# Altium project MainBoard.PrjPcb
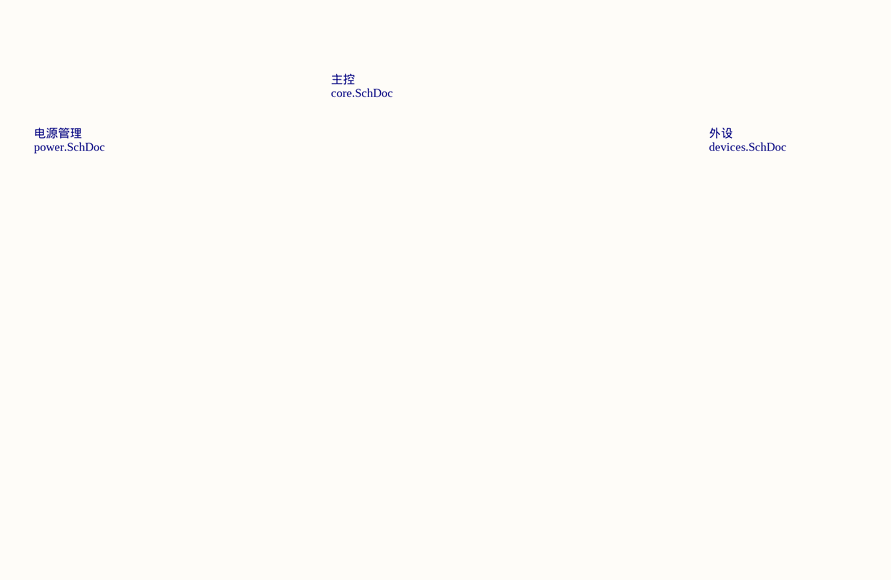
[diagram p0: main.SchDoc]
4 sheets, 74 parts. Net scope: flat (ports and power ports of the same name join across sheets).
Board file: MainBoard.PcbDoc
Sheets:
  main.SchDoc
    主控 = core.SchDoc
    电源管理 = power.SchDoc
    外设 = devices.SchDoc

## Sheet main.SchDoc
size A4

### Parts
LOGO1  (no value)  [JMU_LOGO(1.35cm)]

### Sub-sheets
主控 = core.SchDoc: no entries
外设 = devices.SchDoc: no entries
电源管理 = power.SchDoc: no entries

### Library data of the parts
LOGO1 = JMU_LOGO: LOGO

## Sheet core.SchDoc
size A4
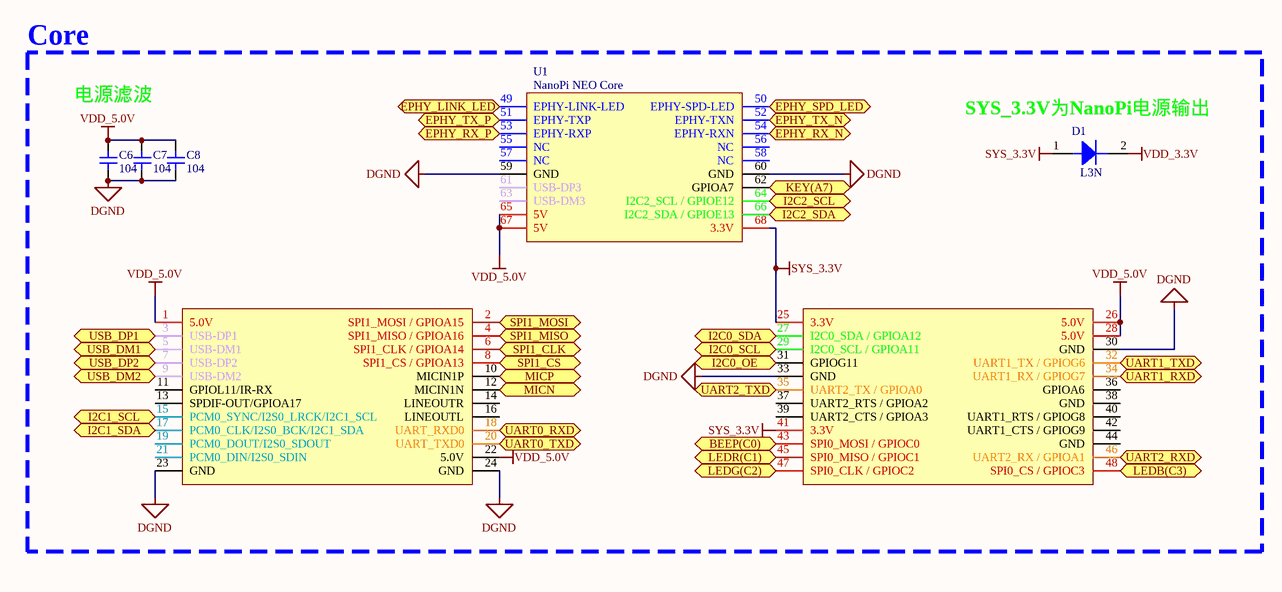
[diagram p1: core.SchDoc]

### Parts
C6  104  [0805C]
C7  104  [0805C]
C8  104  [0805C]
D1  L3N  [SOD-123]
U1  NanoPi NEO Core  [NanoPi NEO Core(无引脚名)]

### Ports
BEEP(C0), EPHY_LINK_LED, EPHY_RX_N, EPHY_RX_P, EPHY_SPD_LED, EPHY_TX_N, EPHY_TX_P, I2C0_OE, I2C0_SCL, I2C0_SDA, I2C1_SCL, I2C1_SDA, I2C2_SCL, I2C2_SDA, KEY(A7), LEDB(C3), LEDG(C2), LEDR(C1), MICN, MICP, SPI1_CLK, SPI1_CS, SPI1_MISO, SPI1_MOSI, UART0_RXD, UART0_TXD, UART1_RXD, UART1_TXD, UART2_RXD, UART2_TXD, USB_DM1, USB_DM2, USB_DP1, USB_DP2

### Nets
DGND: C6.1 C7.1 C8.1 U1.23(GND) U1.24(GND) U1.30(GND) U1.33(GND) U1.59(GND) U1.60(GND)
SYS_3.3V: D1.1 U1.25(3.3V) U1.41(3.3V) U1.68(3.3V)
VDD_3.3V: D1.2
VDD_5.0V: C6.2 C7.2 C8.2 U1.1(5.0V) U1.22(5.0V) U1.26(5.0V) U1.28(5.0V) U1.65(5V) U1.67(5V)
BEEP(C0): U1.43(SPI0_MOSI_/_GPIOC0) ; port BEEP(C0)
EPHY_LINK_LED: U1.49(EPHY-LINK-LED) ; port EPHY_LINK_LED
EPHY_SPD_LED: U1.50(EPHY-SPD-LED) ; port EPHY_SPD_LED
I2C0_OE: U1.31(GPIOG11) ; port I2C0_OE
I2C0_SCL: U1.29(I2C0_SCL_/_GPIOA11) ; port I2C0_SCL
I2C0_SDA: U1.27(I2C0_SDA_/_GPIOA12) ; port I2C0_SDA
I2C1_SCL: U1.15(PCM0_SYNC/I2S0_LRCK/I2C1_SCL) ; port I2C1_SCL
I2C1_SDA: U1.17(PCM0_CLK/I2S0_BCK/I2C1_SDA) ; port I2C1_SDA
I2C2_SCL: U1.64(I2C2_SCL_/_GPIOE12) ; port I2C2_SCL
I2C2_SDA: U1.66(I2C2_SDA_/_GPIOE13) ; port I2C2_SDA
KEY(A7): U1.62(GPIOA7) ; port KEY(A7)
LEDB(C3): U1.48(SPI0_CS_/_GPIOC3) ; port LEDB(C3)
LEDG(C2): U1.47(SPI0_CLK_/_GPIOC2) ; port LEDG(C2)
LEDR(C1): U1.45(SPI0_MISO_/_GPIOC1) ; port LEDR(C1)
MICN: U1.12(MICIN1N) ; port MICN
MICP: U1.10(MICIN1P) ; port MICP
RXIN: U1.54(EPHY-RXN) ; port EPHY_RX_N
RXIP: U1.53(EPHY-RXP) ; port EPHY_RX_P
SPI1_CLK: U1.6(SPI1_CLK_/_GPIOA14) ; port SPI1_CLK
SPI1_CS: U1.8(SPI1_CS_/_GPIOA13) ; port SPI1_CS
SPI1_MISO: U1.4(SPI1_MISO_/_GPIOA16) ; port SPI1_MISO
SPI1_MOSI: U1.2(SPI1_MOSI_/_GPIOA15) ; port SPI1_MOSI
TXON: U1.52(EPHY-TXN) ; port EPHY_TX_N
TXOP: U1.51(EPHY-TXP) ; port EPHY_TX_P
UART0_RXD: U1.18(UART_RXD0) ; port UART0_RXD
UART0_TXD: U1.20(UART_TXD0) ; port UART0_TXD
UART1_RXD: U1.34(UART1_RX_/_GPIOG7) ; port UART1_RXD
UART1_TXD: U1.32(UART1_TX_/_GPIOG6) ; port UART1_TXD
UART2_RXD: U1.46(UART2_RX_/_GPIOA1) ; port UART2_RXD
UART2_TXD: U1.35(UART2_TX_/_GPIOA0) ; port UART2_TXD
USB_DM1: U1.5(USB-DM1) ; port USB_DM1
USB_DM2: U1.9(USB-DM2) ; port USB_DM2
USB_DP1: U1.3(USB-DP1) ; port USB_DP1
USB_DP2: U1.7(USB-DP2) ; port USB_DP2

Not connected (* = marked no-connect by the designer): U1 11(GPIOL11/IR-RX) 13(SPDIF-OUT/GPIOA17) 14(LINEOUTR) 16(LINEOUTL) 19(PCM0_DOUT/I2S0_SDOUT) 21(PCM0_DIN/I2S0_SDIN) 36(GPIOA6) 37(UART2_RTS_/_GPIOA2) 38(GND) 39(UART2_CTS_/_GPIOA3) 40(UART1_RTS_/_GPIOG8) 42(UART1_CTS_/_GPIOG9) 44(GND) 55(NC) 56(NC) 57(NC) 58(NC) 61(USB-DP3) 63(USB-DM3)

### Notes on the sheet
- Core
- 电源滤波
- (near U1) SYS_3.3V为NanoPi电源输出

### Library data of the parts
C6-C8 = Cap1: 无极贴片电容
D1 = Diode: 二极管30V/2A

## Sheet power.SchDoc
size A3
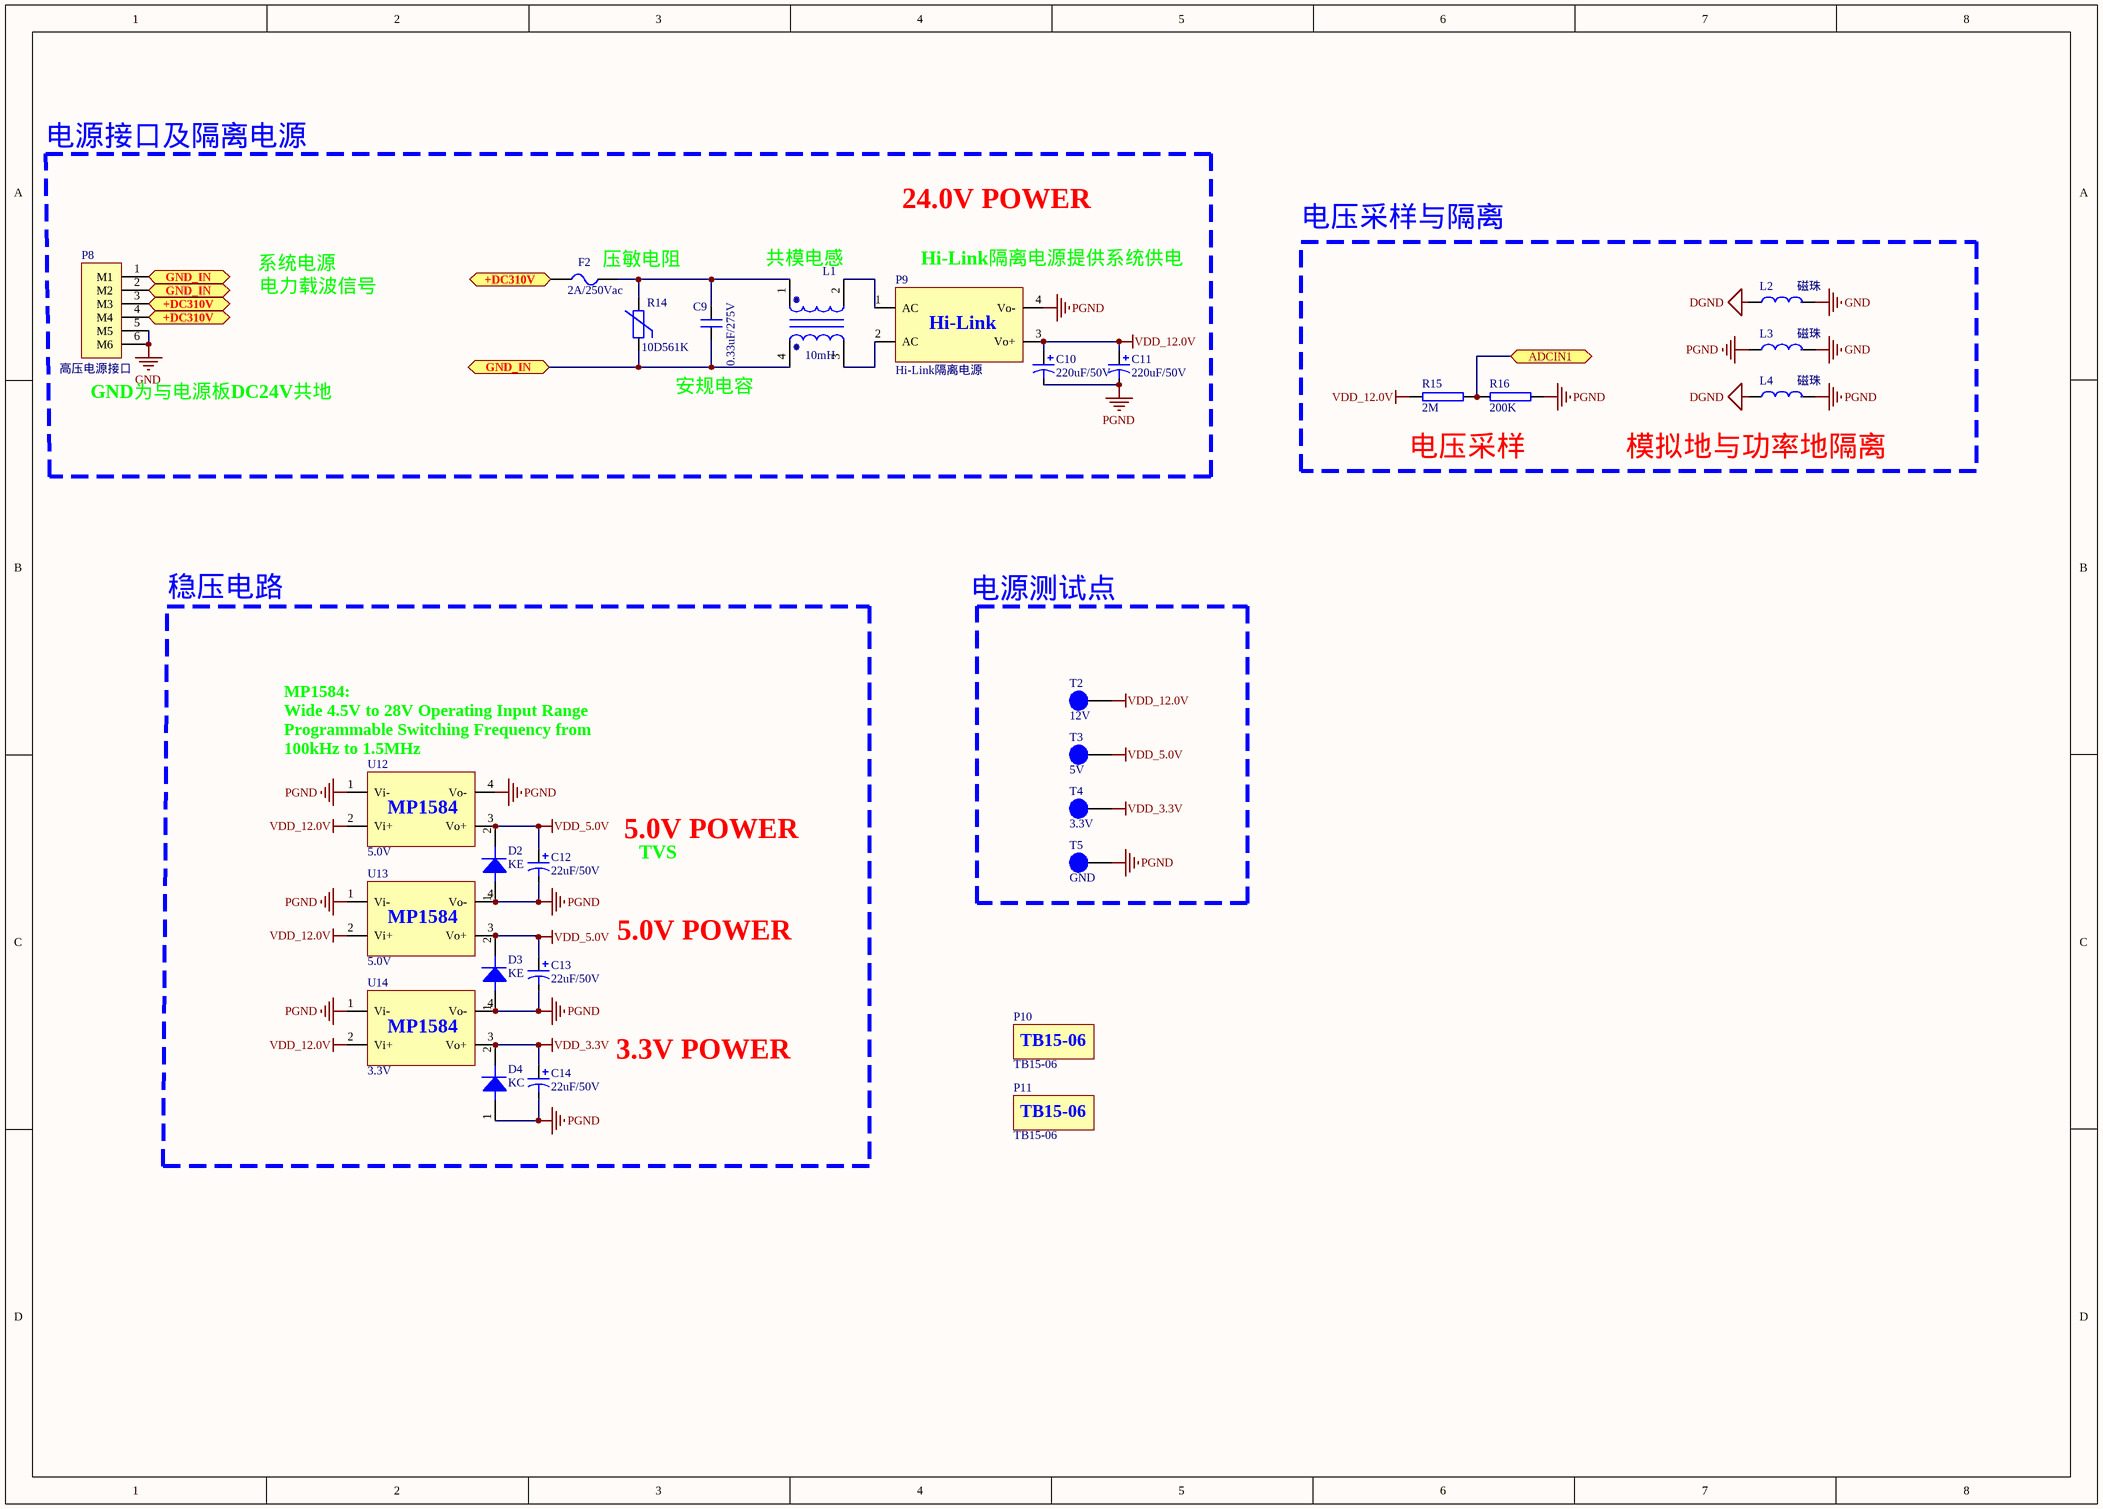
[diagram p2: power.SchDoc]

### Parts
C9  0.33uF/275V  [CX 15*18*11]
C10  220uF/50V  [CAP 5.0*10*12.5-H - GD]
C11  220uF/50V  [CAP 5.0*10*12.5-H - GD]
C12  22uF/50V  [CM D(6.3*5.4)]
C13  22uF/50V  [CM D(6.3*5.4)]
C14  22uF/50V  [CM D(6.3*5.4)]
D2  KE  [SMA]
D3  KE  [SMA]
D4  KC  [SMA]
F2  2A/250Vac  [FU 5x20]
L1  10mH  [T12x6x4]
L2  磁珠  [1206L]
L3  磁珠  [1206L]
L4  磁珠  [1206L]
P8  高压电源接口  [PH2.0WS-6P]
P9  Hi-Link隔离电源  [HLK-20M24]
P10  TB15-06  [TB1506]
P11  TB15-06  [TB1506]
R14  10D561K  [VDR 10D-4.5]
R15  2M  [0805R]
R16  200K  [0805R]
T2  12V  [HEADER 1]
T3  5V  [HEADER 1]
T4  3.3V  [HEADER 1]
T5  GND  [HEADER 1]
U12  5.0V  [MP1584电源模块]
U13  5.0V  [MP1584电源模块]
U14  3.3V  [MP1584电源模块]

### Ports
+DC310V, +DC310V (bidir), ADCIN1, GND_IN

### Nets
DGND: L2.1 L4.1
GND: L2.2 L3.2 P8.5(M5) P8.6(M6)
PGND: C10.2 C11.2 C12.2 C13.2 C14.2 D2.1 D3.1 D4.1 L3.1 L4.2 P9.4(Vo-) R16.2 T5.1 U12.1(Vi-) U12.4(Vo-) U13.1(Vi-) U13.4(Vo-) U14.1(Vi-) U14.4(Vo-)
VDD_3.3V: C14.1 D4.2 T4.1 U14.3(Vo+)
VDD_5.0V: C12.1 C13.1 D2.2 D3.2 T3.1 U12.3(Vo+) U13.3(Vo+)
VDD_12.0V: C10.1 C11.1 P9.3(Vo+) R15.1 T2.1 U12.2(Vi+) U13.2(Vi+) U14.2(Vi+)
+DC310V: F2.1 P8.3(M3) P8.4(M4) ; port +DC310V
ADCIN1: R15.2 R16.1 ; port ADCIN1
GND_IN: C9.1 L1.4 P8.1(M1) P8.2(M2) R14.1 ; port GND_IN
NetC9_2: C9.2 F2.2 L1.1 R14.2
NetL1_2: L1.2 P9.1(AC)
NetL1_3: L1.3 P9.2(AC)

### Notes on the sheet
- 电源接口及隔离电源
- 24.0V POWER
- 电压采样与隔离
- 系统电源
- 电力载波信号
- (near F2) 压敏电阻
- (near L1) 共模电感
- (near P9) Hi-Link隔离电源提供系统供电
- (near P8) GND为与电源板DC24V共地
- 安规电容
- 电压采样
- (near L4) 模拟地与功率地隔离
- 稳压电路
- 电源测试点
- (near U12) MP1584:
  Wide 4.5V to 28V Operating Input Range
  Programmable Switching Frequency from
  100kHz to 1.5MHz
- 5.0V POWER
- TVS
- 3.3V POWER
- (in symbol HILINK-24V) Hi-Link
- (in symbol MP1584电源模块) MP1584

### Library data of the parts
C9 = Cap2: 安规电容
C10-C14 = Cap3: 直插极性电容
D2-D4 = Diode: 二极管
F2 = Fuse: 保险丝
L1 = 共模电感
L2-L4 = L: 电感
P8 = 接线端子-6PIN: 6PIN
P9 = HILINK-24V
R14 = 压敏电阻
R15 R16 = R1
T2-T5 = 测试点
U12-U14 = MP1584电源模块

## Sheet devices.SchDoc
size A3
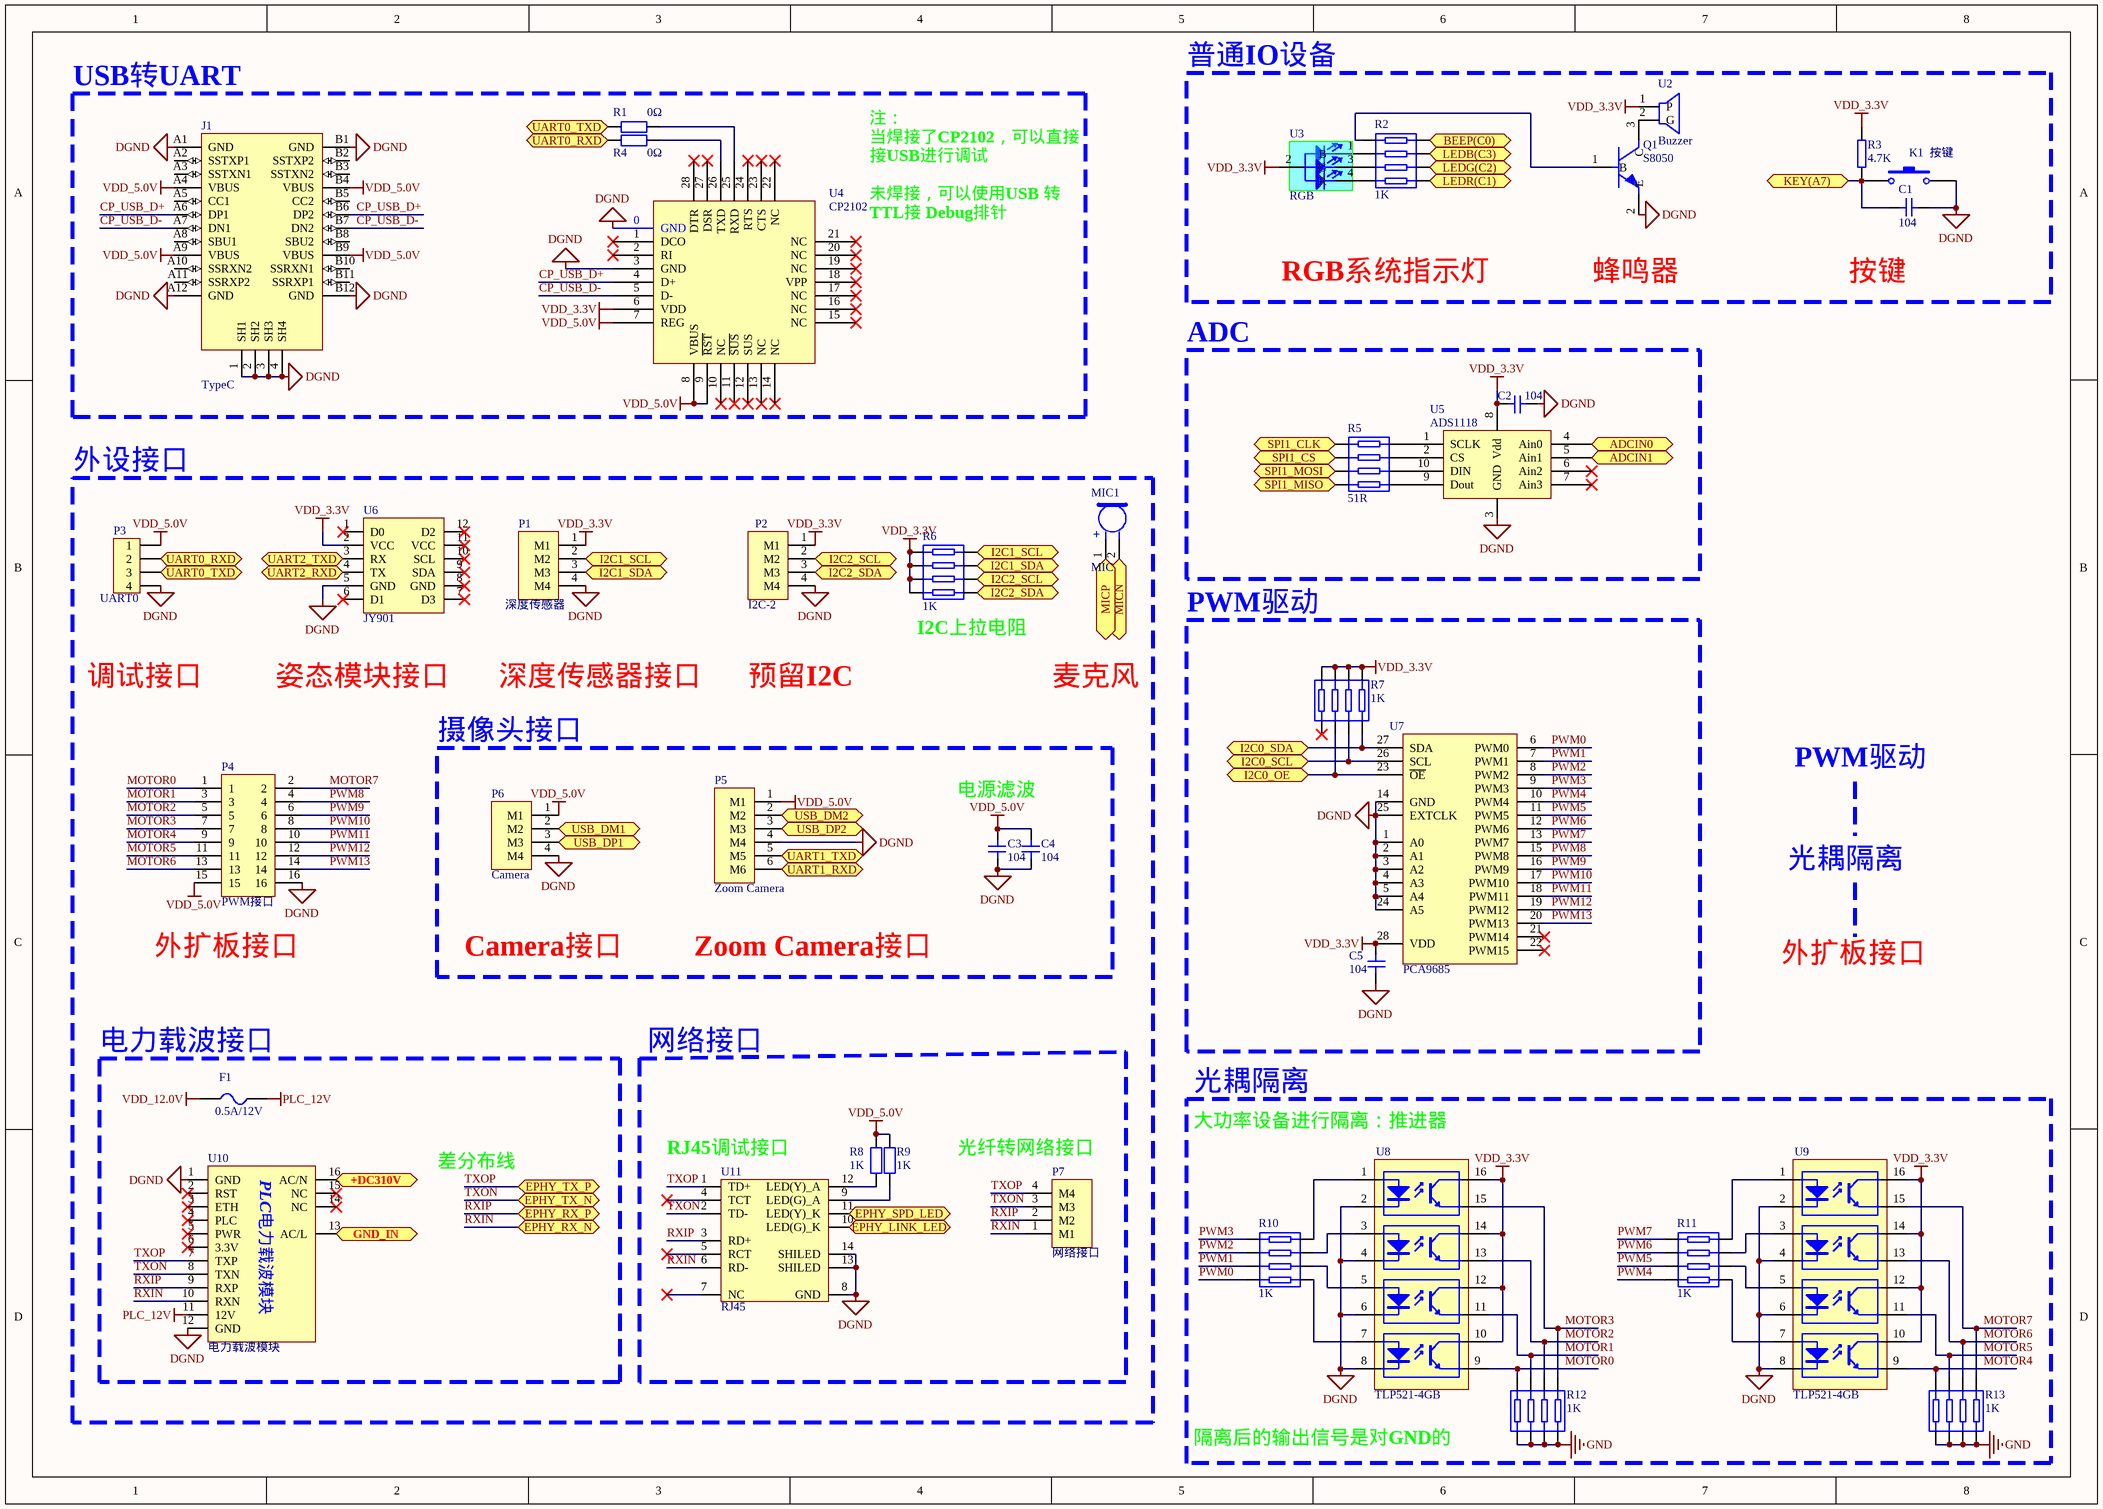
[diagram p3: devices.SchDoc]

### Parts
C1  104  [0805C]
C2  104  [0805C]
C3  104  [0805C]
C4  104  [0805C]
C5  104  [0805C]
F1  0.5A/12V  [1206F]
J1  TypeC  [TYPE-C 16P]
K1  按键  [贴片按键]
MIC1  MIC  [MIC]
P1  深度传感器  [MX1.25WS-4PIN]
P2  I2C-2  [MX1.25WS-4PIN]
P3  UART0  [HDR2.54-WS-4P]
P4  PWM接口  [接线板（ROV PWM）]
P5  Zoom Camera  [PH2.0WS-6P]
P6  Camera  [PH2.0WS-4P]
P7  网络接口  [MX1.25WS-4PIN]
Q1  S8050  [SOT-23]
R1  0Ω  [0805R]
R2  1K  [res-4]
R3  4.7K  [0805R]
R4  0Ω  [0805R]
R5  51R  [res-4]
R6  1K  [res-4]
R7  1K  [res-4]
R8  1K  [0805R]
R9  1K  [0805R]
R10  1K  [res-4]
R11  1K  [res-4]
R12  1K  [res-4]
R13  1K  [res-4]
U2  Buzzer  [MLT-9032]
U3  RGB  [RGB-3528]
U4  CP2102  [QFN-28]
U5  ADS1118  [VSSOP-10]
U6  JY901  [9轴模块(简易版)]
U7  PCA9685  [TSSOP-28]
U8  TLP521-4GB  [SOP16-W2.54_M]
U9  TLP521-4GB  [SOP16-W2.54_M]
U10  电力载波模块  [电力载波模块6410（贴片排母）]
U11  RJ45  [RJ45]

### Blocks framed on the sheet
USB转UART: J1 R1 R4 U4
ADC: C2 R5 U5
PWM驱动: C5 R7 U7
电力载波接口: F1 U10
光耦隔离: R10-R13 U8 U9

### Ports
+DC310V, ADCIN0, ADCIN1, BEEP(C0), EPHY_LINK_LED, EPHY_RX_N, EPHY_RX_P, EPHY_SPD_LED, EPHY_TX_N, EPHY_TX_P, GND_IN, I2C0_OE, I2C0_SCL, I2C0_SDA, I2C1_SCL, I2C1_SDA, I2C2_SCL, I2C2_SDA, KEY(A7), LEDB(C3), LEDG(C2), LEDR(C1), MICN, MICP, SPI1_CLK, SPI1_CS, SPI1_MISO, SPI1_MOSI, UART0_RXD, UART0_TXD, UART1_RXD, UART1_TXD, UART2_RXD, UART2_TXD, USB_DM1, USB_DM2, USB_DP1, USB_DP2

### Nets
DGND: C1.1 C2.2 C3.2 C4.2 C5.1 J1.1(SH1) J1.2(SH2) J1.3(SH3) J1.4(SH4) J1.A1(GND) J1.A12(GND) J1.B1(GND) J1.B12(GND) K1.2 P1.4(M4) P2.4(M4) P3.4 P4.16 P5.4(M4) P6.4(M4) Q1.2(E) U4.0(GND) U4.3(GND) U5.3(GND) U6.5(GND) U7.1(A0) U7.2(A1) U7.3(A2) U7.4(A3) U7.5(A4) U7.14(GND) U7.24(A5) U7.25(EXTCLK) U8.2(K) U8.4(K) U8.6(K) U8.8(K) U9.2(K) U9.4(K) U9.6(K) U9.8(K) U10.1(GND) U10.12(GND) U11.8(GND) U11.13(SHILED) U11.14(SHILED)
GND: R12.1 R12.2 R12.3 R12.4 R13.1 R13.2 R13.3 R13.4
PLC_12V: F1.2 U10.11(12V)
VDD_3.3V: C2.1 C5.2 P1.1(M1) P2.1(M1) R3.2 R6.1 R6.2 R6.3 R6.4 R7.5 R7.6 R7.7 R7.8 U2.1(P) U3.2 U4.6(VDD) U5.8(Vdd) U6.2(VCC) U7.28(VDD) U8.10(C) U8.12(C) U8.14(C) U8.16(C) U9.10(C) U9.12(C) U9.14(C) U9.16(C)
VDD_5.0V: C3.1 C4.1 J1.A4(VBUS) J1.A9(VBUS) J1.B4(VBUS) J1.B9(VBUS) P3.1 P4.15 P5.1(M1) P6.1(M1) R8.1 R9.1 U4.7(REG) U4.8(VBUS) U4.9(~{RST})
VDD_12.0V: F1.1
+DC310V: U10.16(AC/N) ; port +DC310V
ADCIN0: U5.4(Ain0) ; port ADCIN0
ADCIN1: U5.5(Ain1) ; port ADCIN1
BEEP(C0): R2.8 ; port BEEP(C0)
CP_USB_D+: J1.A6(DP1) J1.B6(DP2) U4.4(D+)
CP_USB_D-: J1.A7(DN1) J1.B7(DN2) U4.5(D-)
EPHY_LINK_LED: U11.10(LED(G)_K) ; port EPHY_LINK_LED
EPHY_SPD_LED: U11.11(LED(Y)_K) ; port EPHY_SPD_LED
GND_IN: U10.13(AC/L) ; port GND_IN
I2C0_OE: R7.2 U7.23(~{OE}) ; port I2C0_OE
I2C0_SCL: R7.3 U7.26(SCL) ; port I2C0_SCL
I2C0_SDA: R7.4 U7.27(SDA) ; port I2C0_SDA
I2C1_SCL: P1.2(M2) R6.8 ; port I2C1_SCL
I2C1_SDA: P1.3(M3) R6.7 ; port I2C1_SDA
I2C2_SCL: P2.2(M2) R6.6 ; port I2C2_SCL
I2C2_SDA: P2.3(M3) R6.5 ; port I2C2_SDA
KEY(A7): C1.2 K1.1 R3.1 ; port KEY(A7)
LEDB(C3): R2.7 ; port LEDB(C3)
LEDG(C2): R2.6 ; port LEDG(C2)
LEDR(C1): R2.5 ; port LEDR(C1)
MICN: MIC1.2(N) ; port MICN
MICP: MIC1.1(P) ; port MICP
MOTOR0: P4.1 R12.8 U8.9(E)
MOTOR1: P4.3 R12.7 U8.11(E)
MOTOR2: P4.5 R12.6 U8.13(E)
MOTOR3: P4.7 R12.5 U8.15(E)
MOTOR4: P4.9 R13.8 U9.9(E)
MOTOR5: P4.11 R13.7 U9.11(E)
MOTOR6: P4.13 R13.6 U9.13(E)
MOTOR7: P4.2 R13.5 U9.15(E)
PWM0: R10.8 U7.6(PWM0)
PWM1: R10.7 U7.7(PWM1)
PWM2: R10.6 U7.8(PWM2)
PWM3: R10.5 U7.9(PWM3)
PWM4: R11.4 U7.10(PWM4)
PWM5: R11.3 U7.11(PWM5)
PWM6: R11.2 U7.12(PWM6)
PWM7: R11.1 U7.13(PWM7)
PWM8: P4.4 U7.15(PWM8)
PWM9: P4.6 U7.16(PWM9)
PWM10: P4.8 U7.17(PWM10)
PWM11: P4.10 U7.18(PWM11)
PWM12: P4.12 U7.19(PWM12)
PWM13: P4.14 U7.20(PWM13)
RXIN: P7.1(M1) U10.10(RXN) U11.6(RD-) ; port EPHY_RX_N
RXIP: P7.2(M2) U10.9(RXP) U11.3(RD+) ; port EPHY_RX_P
SPI1_CLK: R5.1 ; port SPI1_CLK
SPI1_CS: R5.2 ; port SPI1_CS
SPI1_MISO: R5.4 ; port SPI1_MISO
SPI1_MOSI: R5.3 ; port SPI1_MOSI
TXON: P7.3(M3) U10.8(TXN) U11.2(TD-) ; port EPHY_TX_N
TXOP: P7.4(M4) U10.7(TXP) U11.1(TD+) ; port EPHY_TX_P
UART0_RXD: P3.2 R4.2 ; port UART0_RXD
UART0_TXD: P3.3 R1.2 ; port UART0_TXD
UART1_RXD: P5.6(M6) ; port UART1_RXD
UART1_TXD: P5.5(M5) ; port UART1_TXD
UART2_RXD: U6.4(TX) ; port UART2_RXD
UART2_TXD: U6.3(RX) ; port UART2_TXD
USB_DM1: P6.2(M2) ; port USB_DM1
USB_DM2: P5.2(M2) ; port USB_DM2
USB_DP1: P6.3(M3) ; port USB_DP1
USB_DP2: P5.3(M3) ; port USB_DP2
NetQ1_1: Q1.1(B) R2.1
NetQ1_3: Q1.3(C) U2.2(G)
NetR1_1: R1.1 U4.25(RXD)
NetR2_2: R2.2 U3.1(B)
NetR2_3: R2.3 U3.3(G)
NetR2_4: R2.4 U3.4(R)
NetR4_1: R4.1 U4.26(TXD)
NetR5_5: R5.5 U5.9(Dout)
NetR5_6: R5.6 U5.10(DIN)
NetR5_7: R5.7 U5.2(CS)
NetR5_8: R5.8 U5.1(SCLK)
NetR8_2: R8.2 U11.12(LED(Y)_A)
NetR9_2: R9.2 U11.9(LED(G)_A)
NetR10_1: R10.1 U8.7(A)
NetR10_2: R10.2 U8.5(A)
NetR10_3: R10.3 U8.3(A)
NetR10_4: R10.4 U8.1(A)
NetR11_5: R11.5 U9.7(A)
NetR11_6: R11.6 U9.5(A)
NetR11_7: R11.7 U9.3(A)
NetR11_8: R11.8 U9.1(A)

Not connected (* = marked no-connect by the designer): J1 A2(SSTXP1) A3(SSTXN1) A5(CC1) A8(SBU1) A10(SSRXN2) A11(SSRXP2) B2(SSTXP2) B3(SSTXN2) B5(CC2) B8(SBU2) B10(SSRXN1) B11(SSRXP1); R7 1*; U4 1(DCO)* 2(RI)* 10(NC)* 11(~{SUS})* 12(SUS)* 13(NC)* 14(NC)* 15(NC)* 16(NC)* 17(NC)* 18(VPP)* 19(NC)* 20(NC)* 21(NC)* 22(NC)* 23(CTS)* 24(RTS)* 27(DSR)* 28(DTR)*; U5 6(Ain2)* 7(Ain3)*; U6 1(D0)* 6(D1)* 7(D3)* 8(GND)* 9(SDA)* 10(SCL)* 11(VCC)* 12(D2)*; U7 21(PWM14)* 22(PWM15)*; U10 2(RST)* 3(ETH)* 4(PLC)* 5(PWR)* 6(3.3V)* 14(NC)* 15(NC)*; U11 4(TCT)* 5(RCT)* 7(NC)*

### Notes on the sheet
- 普通IO设备
- 注：
  当焊接了CP2102，可以直接接USB进行调试
  未焊接，可以使用USB 转TTL接 Debug排针
- RGB系统指示灯
- 蜂鸣器
- 按键
- 外设接口
- (near R6) I2C上拉电阻
- 调试接口
- 姿态模块接口
- 深度传感器接口
- 预留I2C
- 麦克风
- 摄像头接口
- PWM驱动
- 电源滤波
- 光耦隔离
- (near P4) 外扩板接口
- Camera接口
- Zoom Camera接口
- 外扩板接口
- 网络接口
- 大功率设备进行隔离：推进器
- 差分布线
- (near U11) RJ45调试接口
- 光纤转网络接口
- 隔离后的输出信号是对GND的
- (in symbol MIC) +
- (in symbol 电力载波模块6410) PLC电力载波模块

### Library data of the parts
C1-C5 = Cap1: 无极贴片电容
F1 = Fuse: 保险丝
K1 = 贴片按键: 轻触开关
P1 P2 P6 P7 = 接线端子-4PIN: 4PIN
P3 = Header 4: 排针
P4 = Header 2X8
P5 = 接线端子-6PIN: 6PIN
Q1 = NPN: NPN三极管
R1 R3 R4 R8 R9 = Res: 电阻
R2 R5-R7 R10-R13 = Res-4: 排阻
U2 = Buzzer: 蜂鸣器
U4 = CP2102: USB转串口芯片
U6 = 9轴加速度计
U10 = 电力载波模块6410

## Nets that join several sheets
DGND: core (9 pins), power (L2.1 L4.1), devices (46 pins)
GND: power (L2.2 L3.2 P8.5 P8.6), devices (8 pins)
VDD_3.3V: core (D1.2), power (C14.1 D4.2 T4.1 U14.3), devices (27 pins)
VDD_5.0V: core (9 pins), power (7 pins), devices (15 pins)
VDD_12.0V: power (8 pins), devices (F1.1)
+DC310V: power (F2.1 P8.3 P8.4), devices (U10.16)
ADCIN1: power (R15.2 R16.1), devices (U5.5)
BEEP(C0): core (U1.43), devices (R2.8)
EPHY_LINK_LED: core (U1.49), devices (U11.10)
EPHY_SPD_LED: core (U1.50), devices (U11.11)
GND_IN: power (5 pins), devices (U10.13)
I2C0_OE: core (U1.31), devices (R7.2 U7.23)
I2C0_SCL: core (U1.29), devices (R7.3 U7.26)
I2C0_SDA: core (U1.27), devices (R7.4 U7.27)
I2C1_SCL: core (U1.15), devices (P1.2 R6.8)
I2C1_SDA: core (U1.17), devices (P1.3 R6.7)
I2C2_SCL: core (U1.64), devices (P2.2 R6.6)
I2C2_SDA: core (U1.66), devices (P2.3 R6.5)
KEY(A7): core (U1.62), devices (C1.2 K1.1 R3.1)
LEDB(C3): core (U1.48), devices (R2.7)
LEDG(C2): core (U1.47), devices (R2.6)
LEDR(C1): core (U1.45), devices (R2.5)
MICN: core (U1.12), devices (MIC1.2)
MICP: core (U1.10), devices (MIC1.1)
RXIN: core (U1.54), devices (P7.1 U10.10 U11.6)
RXIP: core (U1.53), devices (P7.2 U10.9 U11.3)
SPI1_CLK: core (U1.6), devices (R5.1)
SPI1_CS: core (U1.8), devices (R5.2)
SPI1_MISO: core (U1.4), devices (R5.4)
SPI1_MOSI: core (U1.2), devices (R5.3)
TXON: core (U1.52), devices (P7.3 U10.8 U11.2)
TXOP: core (U1.51), devices (P7.4 U10.7 U11.1)
UART0_RXD: core (U1.18), devices (P3.2 R4.2)
UART0_TXD: core (U1.20), devices (P3.3 R1.2)
UART1_RXD: core (U1.34), devices (P5.6)
UART1_TXD: core (U1.32), devices (P5.5)
UART2_RXD: core (U1.46), devices (U6.4)
UART2_TXD: core (U1.35), devices (U6.3)
USB_DM1: core (U1.5), devices (P6.2)
USB_DM2: core (U1.9), devices (P5.2)
USB_DP1: core (U1.3), devices (P6.3)
USB_DP2: core (U1.7), devices (P5.3)